# Altium schematic sheet PowerSupplie.SchDoc
size 414 x 293 mm; SheetNumber: 4; SheetTotal: 4; PageSetup: Record=PageOptionsZCenterHorizontal=TrueZCenterVertical=TrueZPrintScale=1.00ZXCorrection=0.00ZYCorrection=0.00ZPrintKind=1ZBorderSize=5000000ZLeftOffset=0ZBottomOffset=0ZOrientation=2ZPaperLength=1000ZPaperWidth=1000ZScale=100ZPaperSource=7ZPrintQuality=-4ZMediaType=1ZDitherType=10ZPaperKind=A3ZPrintScaleMode=0; Razrabotal: {Разработал}; Proveril: {Проверил}; Tkontr: {Т.контр.}; Nkontr: {Н.контр.}; Ytverdil: {Утвердил}; Nazvanie1: {Название1}; Nazvanie2: {Название2}; Oboznachenie: {Обозначение}
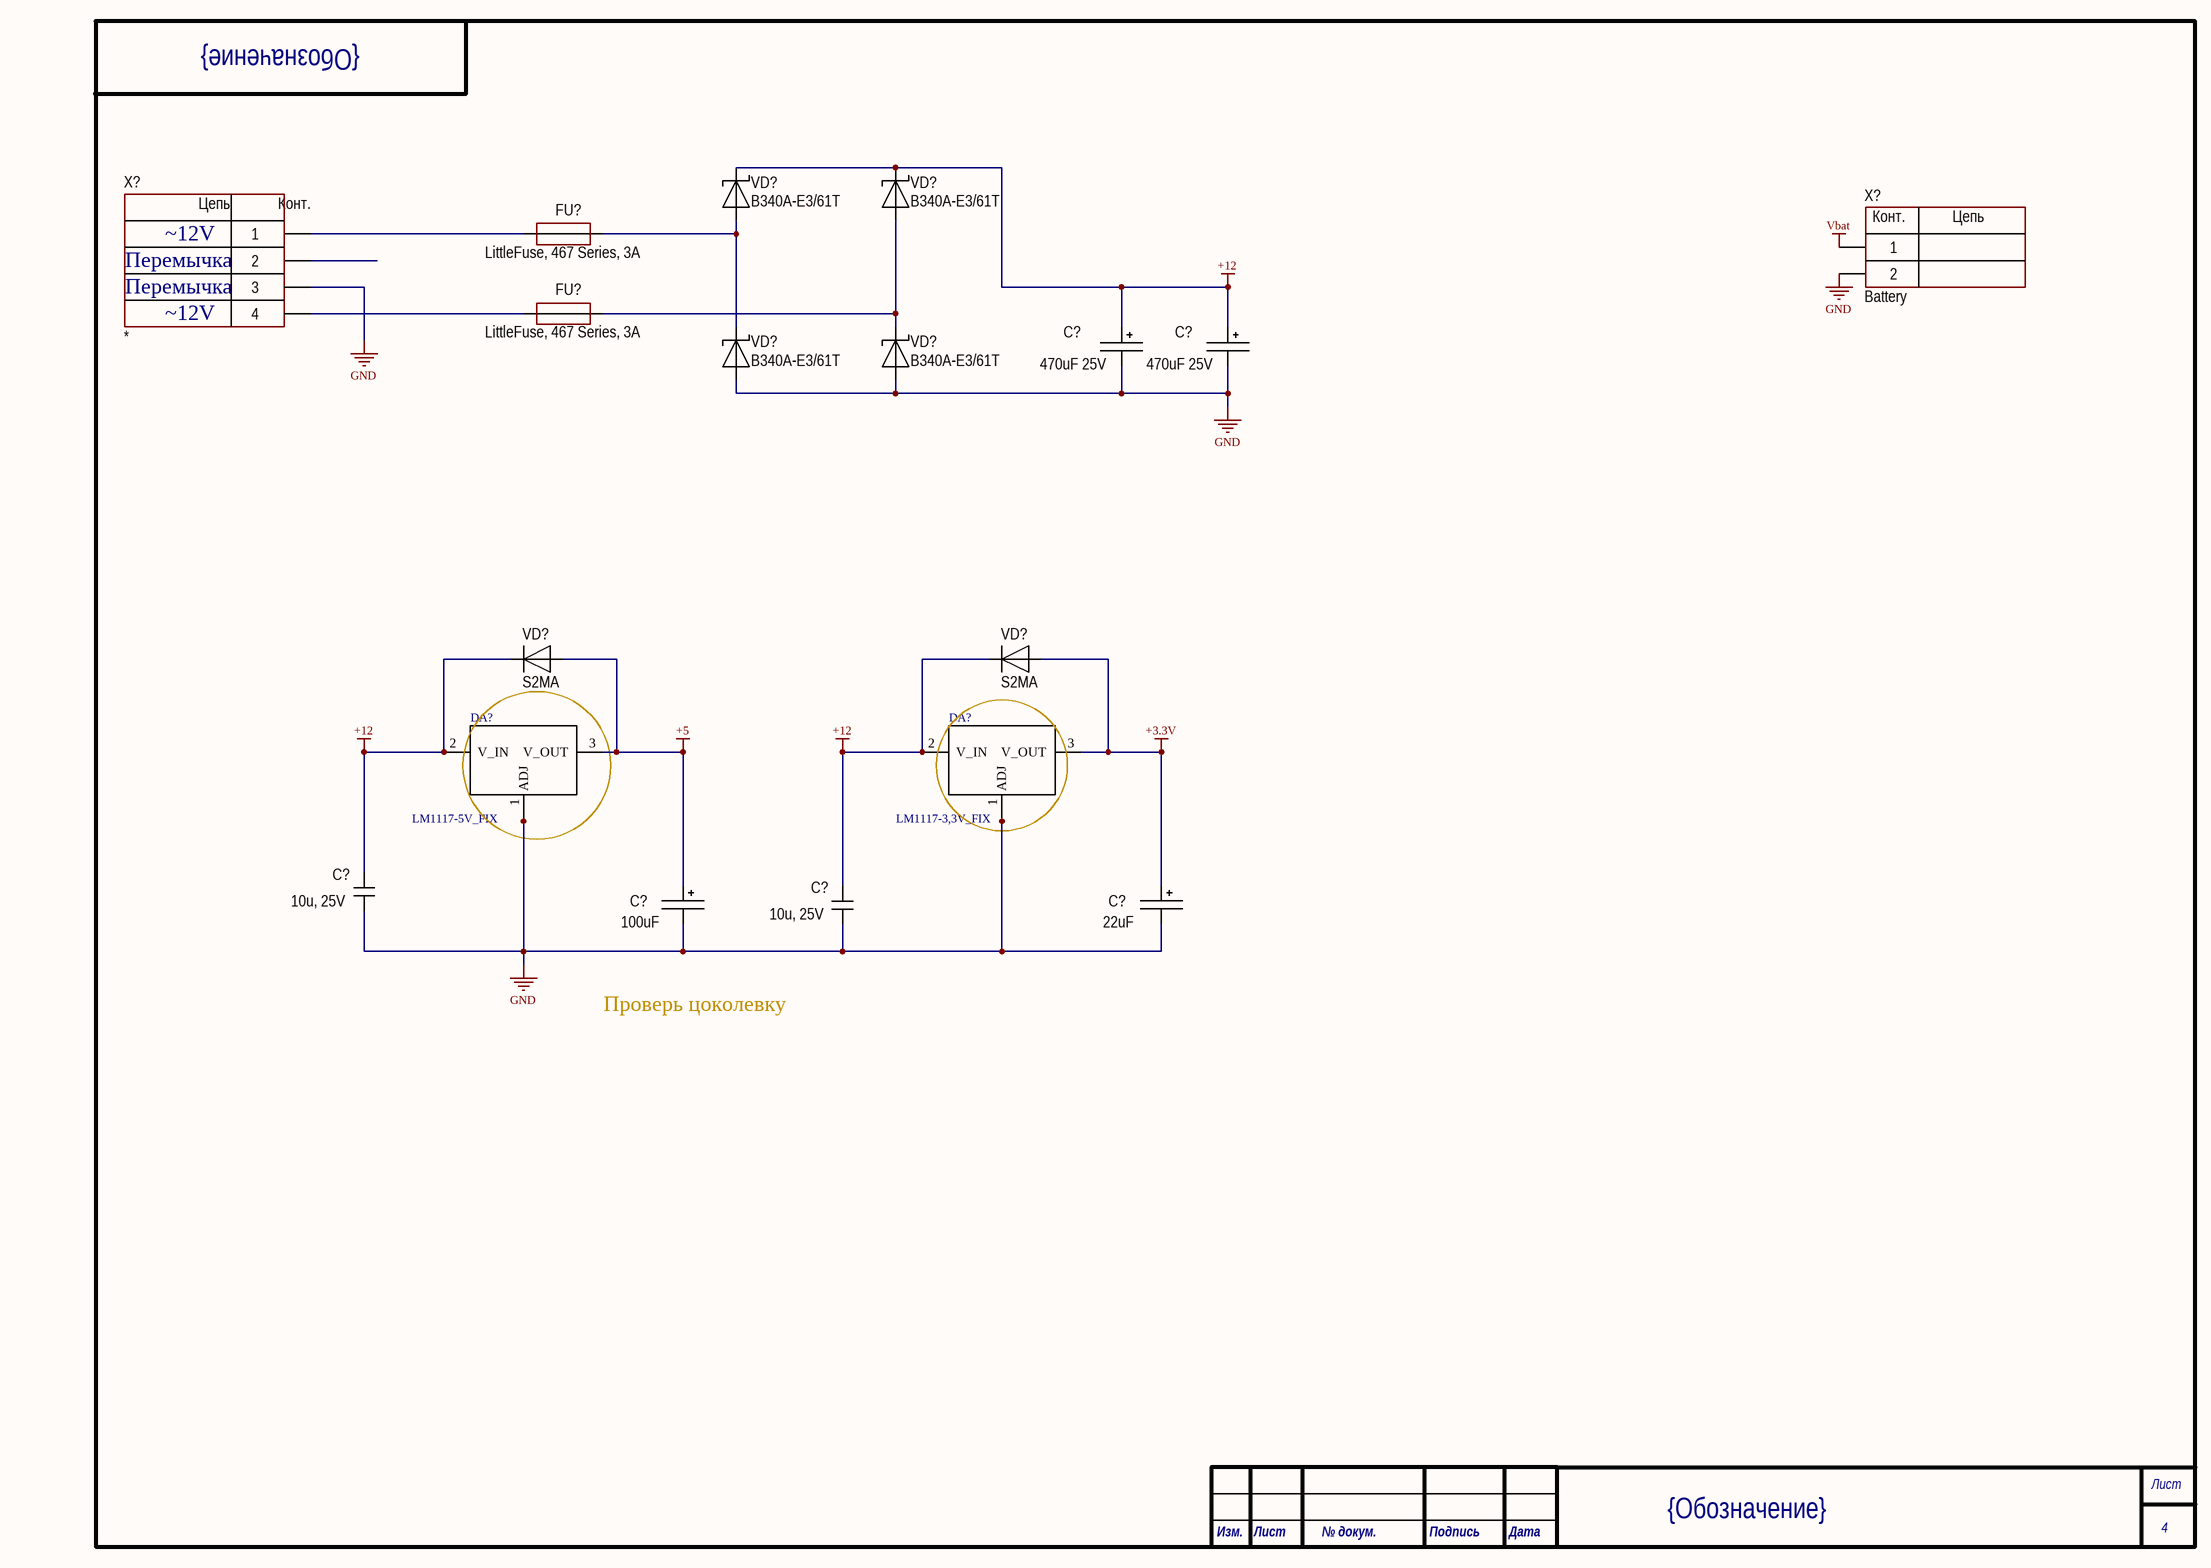
[diagram p0: PowerSupplie.SchDoc]

## Parts
(Parts that share a designator on the sheet are numbered #1, #2 ... from top to bottom, then left to right.)
C?#1  470uF 25V  [D10C4.4H10]
C?#2  470uF 25V  [D10C4.4H10]
C?#3  100uF  [TANTAL_D]
C?#4  22uF  [TANTAL_D]
C?#5  10u, 25V  [CH0805C]
C?#6  10u, 25V  [CH0805C]
DA?#1  LM1117-5V_FIX  [SOT223_123]
DA?#2  LM1117-3,3V_FIX  [SOT223_123]
FU?#1  LittleFuse, 467 Series, 3A  [CH0603F]
FU?#2  LittleFuse, 467 Series, 3A  [CH0603F]
VD?#1  B340A-E3/61T  [SMA]
VD?#2  B340A-E3/61T  [SMA]
VD?#3  B340A-E3/61T  [SMA]
VD?#4  B340A-E3/61T  [SMA]
VD?#5  S2MA  [SMA]
VD?#6  S2MA  [SMA]
X?#1  *  [CON: CWF-4]
X?#2  Battery  [CON: WJ06-02P]

## Nets
+3.3V: C?#4.1 DA?#2.3(V_OUT) VD?#6.1
+5: C?#3.1 DA?#1.3(V_OUT) VD?#5.1
+12: C?#1.1 C?#2.1 C?#5.2 C?#6.2 DA?#1.2(V_IN) DA?#2.2(V_IN) VD?#1.2 VD?#2.2 VD?#5.2 VD?#6.2
GND: C?#1.2 C?#2.2 C?#3.2 C?#4.2 C?#5.1 C?#6.1 DA?#1.1(ADJ) DA?#2.1(ADJ) VD?#3.1 VD?#4.1 X?#1.3 X?#2.2
Vbat: X?#2.1
NetFU?#1_1: FU?#1.1 X?#1.1
NetFU?#1_2: FU?#1.2 VD?#1.1 VD?#3.2
NetFU?#2_1: FU?#2.1 X?#1.4
NetFU?#2_2: FU?#2.2 VD?#2.1 VD?#4.2

Not connected (* = marked no-connect by the designer): X?#1 2

## Notes on the sheet
- Перемычка
- ~12V
- Проверь цоколевку
- Лист
- Изм.
- № докум.
- Подпись
- Дата
- (in symbol 2-Connector) Конт.; Цепь
- (in symbol 4-Connector) Цепь; Конт.

## Library data of the parts
C?#1 C?#2 = AlumCap: Manufacturer: *; Model: *; HelpURL: *; ComponentKind: *; Value: *
C?#3 C?#4 = TantalCap: Manufacturer: *; Model: *; HelpURL: *; ComponentKind: *; Value: *
C?#5 C?#6 = Capacitor: Manufacturer: *; Model: *; HelpURL: *; ComponentKind: *; Value: *
DA?#1 DA?#2 = LM1117
FU?#1 FU?#2 = Fuse: Manufacturer: *; Model: *; HelpURL: *; ComponentKind: *; Value: *
VD?#1-VD?#4 = Diod Schottky: ComponentKind: *; Manufacturer: *; Model: *; HelpURL: *
VD?#5 VD?#6 = Diod: ComponentKind: *; Manufacturer: *; Model: *; HelpURL: *
X?#1 = 4-Connector: Model: *; Manufacturer: *; HelpURL: *; ComponentKind: *
X?#2 = 2-Connector: Model: *; Manufacturer: *; HelpURL: *; ComponentKind: *